# Altium schematic sheet signal_path.SchDoc: Signal Path
size A
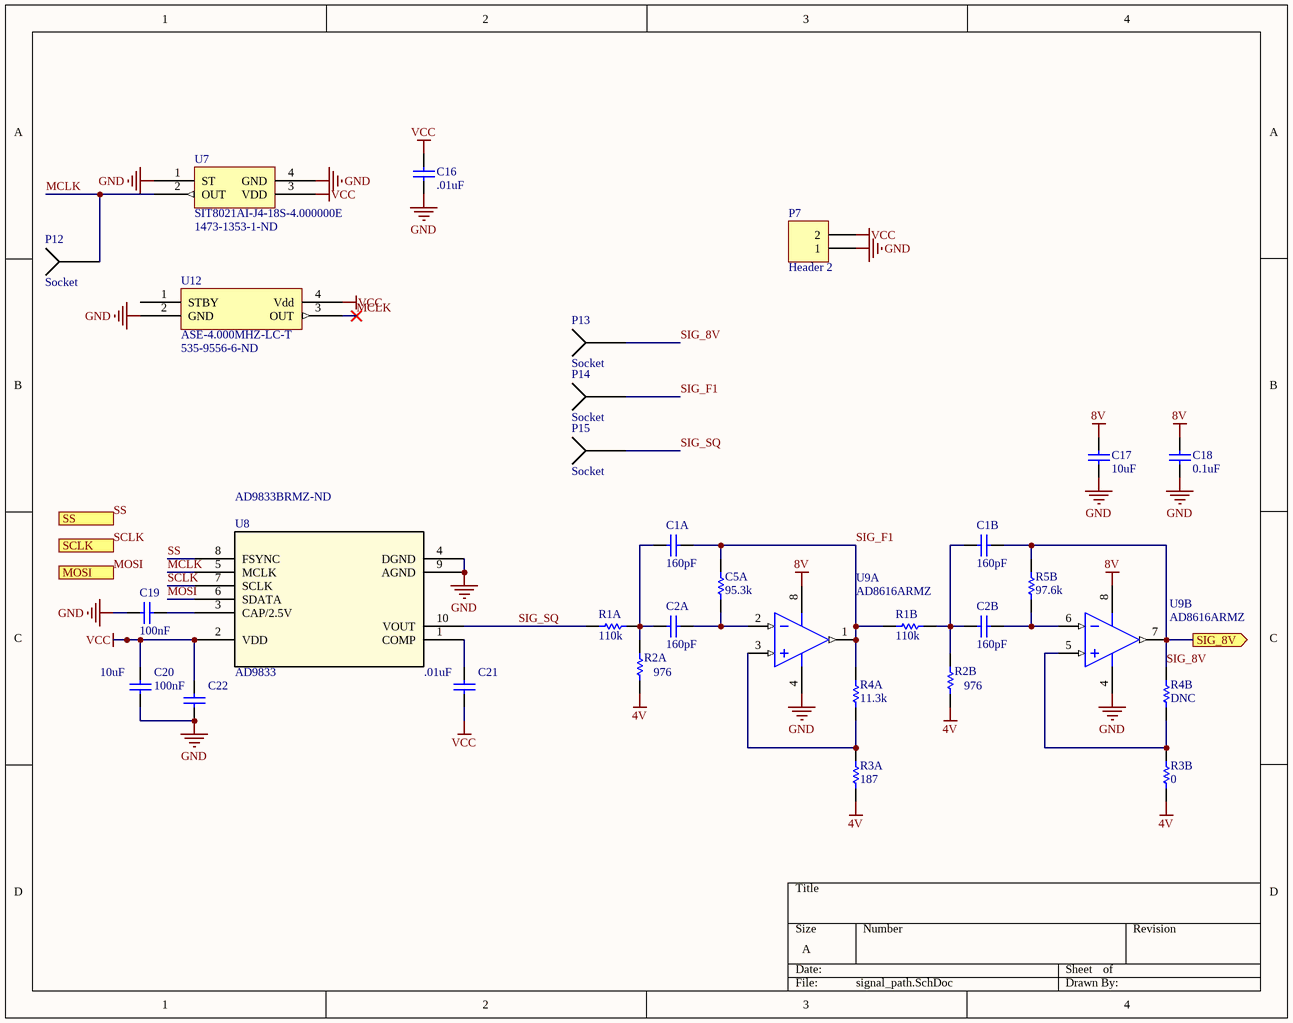
[diagram p0: signal_path.SchDoc]

## Parts
C1A  value 160pF  [0603]  (hidden comment: Cap)
C1B  value 160pF  [0603]  (hidden comment: Cap)
C2A  value 160pF  [0603]  (hidden comment: Cap)
C2B  value 160pF  [0603]  (hidden comment: Cap)
C5A  value 95.3k  [0603]  (hidden comment: Res)
C16  value .01uF  [0603]  (hidden comment: Cap)
C17  value 10uF  [0603]  (hidden comment: Cap)
C18  value 0.1uF  [0603]  (hidden comment: Cap)
C19  value 100nF  [0603]  (hidden comment: Cap)
C20  value 10uF  [0603]  (hidden comment: Cap)
C21  value .01uF  [0603]  (hidden comment: Cap)
C22  value 100nF  [0603]  (hidden comment: Cap)
P7  Header 2  [HDR1X2]
P12  Socket  [socket]
P13  Socket  [socket]
P14  Socket  [socket]
P15  Socket  [socket]
R1A  value 110k  [0603]  (hidden comment: Res)
R1B  value 110k  [0603]  (hidden comment: Res)
R2A  value 976  [0603]  (hidden comment: Res)
R2B  value 976  [0603]  (hidden comment: Res)
R3A  value 187  [0603]  (hidden comment: Res)
R3B  value 0  [0603]  (hidden comment: Res)
R4A  value 11.3k  [0603]  (hidden comment: Res)
R4B  value DNC  [0603]  (hidden comment: Res)
R5B  value 97.6k  [0603]  (hidden comment: Res)
U7  SIT8021AI-J4-18S-4.000000E  Supplier Part Number 1: 1473-1353-1-ND  [SiT8021 - BGA4C100P2X2_154X84X60]
U8  AD9833  Supplier Part Number 1: AD9833BRMZ-ND  [MSOP-10]
U9  AD8616ARMZ  [ADI-RM-8_M]  (parts A,B of 2)
U12  ASE-4.000MHZ-LC-T  Supplier Part Number 1: 535-9556-6-ND  [DFN165P250X120-4N]

## Ports
MOSI (in), SCLK (in), SIG_8V (out), SS (in)

## Nets
4V: R2A.1 R2B.1 R3A.1 R3B.1
8V: C17.1 C18.1 U9.8(+V)
GND: C16.2 C17.2 C18.2 C19.1 C20.2 C22.2 P7.1 U7.1(ST) U7.4(GND) U8.4(DGND) U8.9(AGND) U9.4(-V) U12.2(GND)
VCC: C16.1 C20.1 C21.2 C22.1 P7.2 U7.3(VDD) U8.2(VDD) U12.4(Vdd)
MCLK: P12.0 U7.2(OUT) U8.5(MCLK) U12.3(OUT)
MOSI: U8.6(SDATA) ; port MOSI
SCLK: U8.7(SCLK) ; port SCLK
SIG_8V: C1B.2 P13.0 R4B.2 R5B.2 U9.7(OUT_B) ; port SIG_8V
SIG_F1: C1A.2 C5A.2 P14.0 R1B.1 R4A.2 U9.1(OUT_A)
SIG_SQ: P15.0 R1A.1 U8.10(VOUT)
SS: U8.8(FSYNC) ; port SS
NetC1A_1: C1A.1 C2A.1 R1A.2 R2A.2
NetC1B_1: C1B.1 C2B.1 R1B.2 R2B.2
NetC2A_2: C2A.2 C5A.1 U9.2(-IN_A)
NetC2B_2: C2B.2 R5B.1 U9.6(-IN_B)
NetC19_2: C19.2 U8.3(CAP/2.5V)
NetC21_1: C21.1 U8.1(COMP)
NetR3A_2: R3A.2 R4A.1 U9.3(+IN_A)
NetR3B_2: R3B.2 R4B.1 U9.5(+IN_B)

Not connected (* = marked no-connect by the designer): U12 1(STBY)

## Library data of the parts
C1A C1B C2A C2B C16-C22 = Cap: Ceramic Capacitor (Surface Mount); Manufacturer: Generic Ceramic Chip Cap (TBD); Digi-Key Part Number: *; Manufacturer Part Number: *; Note: *; Rating: *
C5A R1A R1B R2A R2B R3A R3B R4A R4B R5B = Res: Chip Resistor (Surface Mount); Manufacturer: Generic Chip Res (TBD); Manufacturer Part Number: *; Digi-Key Part Number: *; Rating: *
P7 = Header 2: Header, 2-Pin; LatestRevisionDate: 17-Jul-2002; LatestRevisionNote: Re-released for DXP Platform.; Publisher: Altium Limited
U7 = SIT8021AI-J4-18S-4.000000E: 4 MHz low power oscillator; Supplier 1: Digi-Key
U8 = AD9833: MSOP-10; Supplier 1: Digi-Key
U9 = CMP-0384-01709-1: Double Channel Wide Bandwidth Operational Amplifier, 24 MHz BW, 12 V/us SR, Industrial, 8-pin SOP (RM-8), Tube; Generic Part Number: AD8616; Manufacturer: Analog Devices; Amplifiers Per Package: 2; Small Signal Bandwidth: 24MHz; Input Offset Voltage: 23uV; Input Bias Current: 200fA; V Span Min: 2.7V; Iq/Amp: 2mA; Slew Rate: 12V/us; V Span Max: 6V; PackageDescription: 8-Pin Mini Small Outline Package, Body 3 x 3 mm, Pitch 0.65 mm; PartNumber: AD8616ARMZ; ComponentLink2URL: http://www.analog.com/static/imported-files/data_sheets/AD8615_8616_8618.pdf; ComponentLink3URL: http://www.analog.com/static/imported-files/packages/PKG_PDF/MSOP%28RM%29/RM_8.pdf; PackageReference: RM-8; Mounting Technology: Surface Mount; Code_JEDEC: MO-187-AA; ComponentLink1Description: Manufacturer URL; ComponentLink2Description: Datasheet; ComponentLink3Description: Package Specification; ComponentLink1URL: http://www.analog.com/en/index.html; DatasheetVersion: Rev. E; PartId: 1
U12 = ASE-4.000MHZ-LC-T: 4 MHz SMD Oscillator; Supplier 1: Digi-Key